# EAGLE design WS2812-Breakout-v1 (EAGLE 5.12)
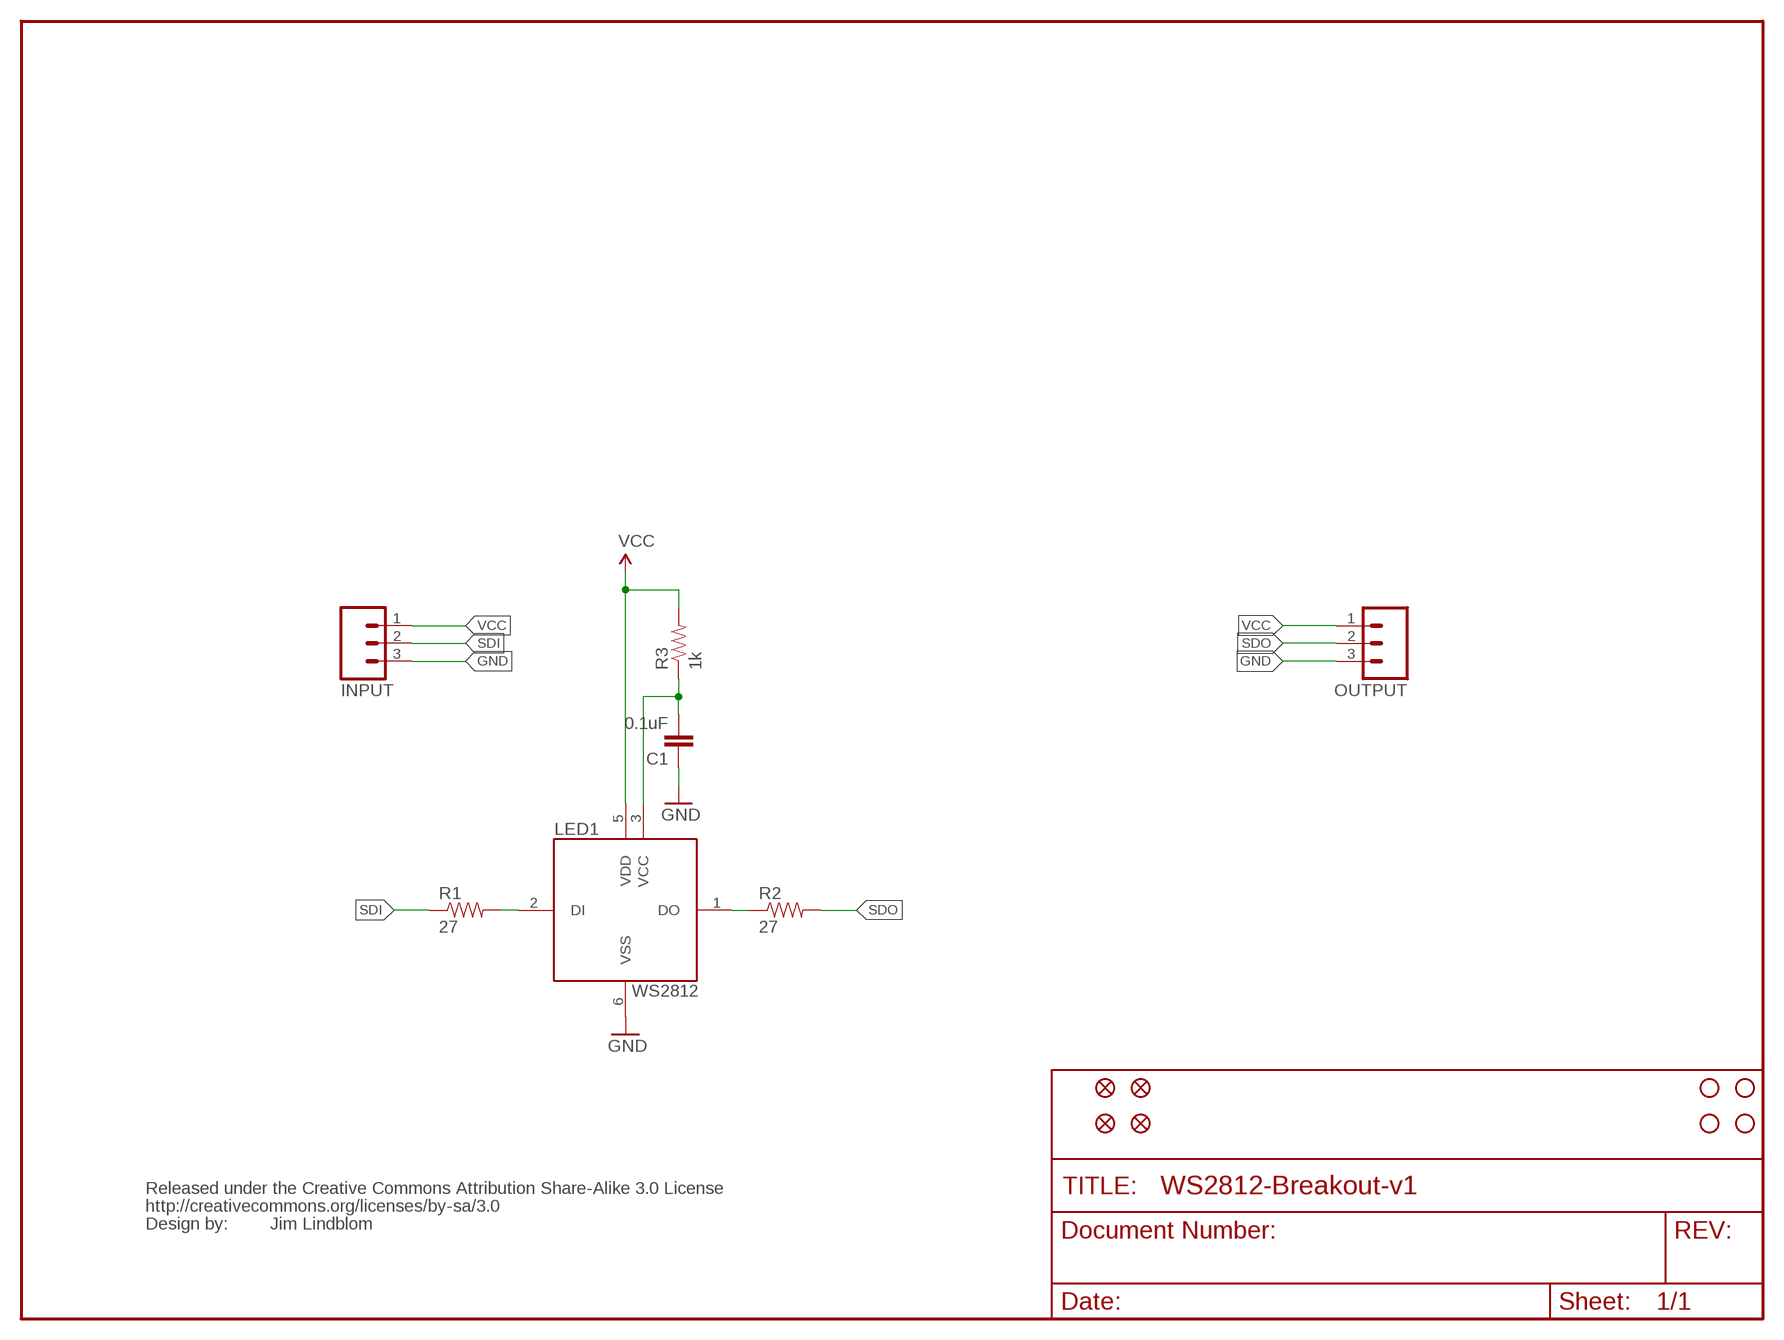
[diagram p0: schematic, sheet 1]

## Parts
C1  0.1uF  CAP0402-CAP  [0402-CAP]
INPUT  M03PTH  [1X03]
JP1  STAND-OFF  [STAND-OFF]
JP2  STAND-OFF  [STAND-OFF]
JP4  STAND-OFF  [STAND-OFF]
JP5  STAND-OFF  [STAND-OFF]
JP6  FIDUCIAL1X2  [FIDUCIAL-1X2]
JP7  FIDUCIAL1X2  [FIDUCIAL-1X2]
JP8  FIDUCIAL1X2  [FIDUCIAL-1X2]
JP9  FIDUCIAL1X2  [FIDUCIAL-1X2]
LED1  WS2812  [LED-TRICOLOR-5050]
OUTPUT  M03PTH  [1X03]
R1  27  RESISTOR0402-RES  [0402-RES]
R2  27  RESISTOR0402-RES  [0402-RES]
R3  1k  RESISTOR0402-RES  [0402-RES]
U$1  CREATIVE_COMMONS  [CREATIVE_COMMONS]

## Nets
GND: C1.1 INPUT.3 LED1.6(VSS) OUTPUT.3
N$1: LED1.2(DI) R1.2
N$2: LED1.1(DO) R2.1
N$3: C1.2 LED1.3(VCC) R3.1
SDI: INPUT.2 R1.1
SDO: OUTPUT.2 R2.2
VCC: INPUT.1 LED1.5(VDD) OUTPUT.1 R3.2

## Notes on the sheet
- Jim Lindblom

## Library data of the parts
C1 = SparkFun:CAP: Capacitor Standard 0603 ceramic capacitor, and 0.1" leaded capacitor.
INPUT OUTPUT = SparkFun:M03: Header 3 Standard 3-pin 0.1" header. Use with straight break away headers (SKU : PRT-00116), right angle break away headers (PRT-00553), swiss pins (PRT-00743), machine pins (PRT-00117), and female headers (PRT-00115). Molex polarized connector foot print use with SKU : PRT-08232 with associated crimp pins and housings.
JP1 JP2 JP4 JP5 = SparkFun:STAND-OFF: Stand Off This is the mechanical footprint for a #4 phillips button head screw. Use the keepout ring to avoid running the screw head into surrounding components. SKU : PRT-00447
JP6-JP9 = SparkFun:FIDUCIAL: Fiducial Alignment Points Various fiducial points for machine vision alignment.
LED1 = rbg-worldsemi-led:WS2812
R1-R3 = SparkFun:RESISTOR: Resistor Basic schematic elements and footprints for 0603, 1206, and PTH resistors.
U$1 = SparkFun:CREATIVE_COMMONS

## Board
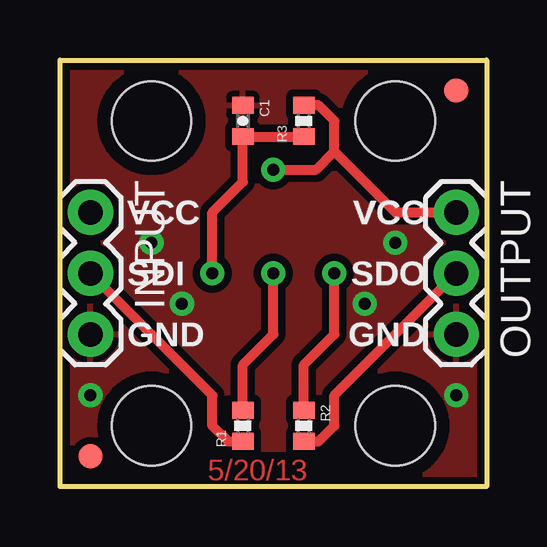
[diagram p1: board, top side]
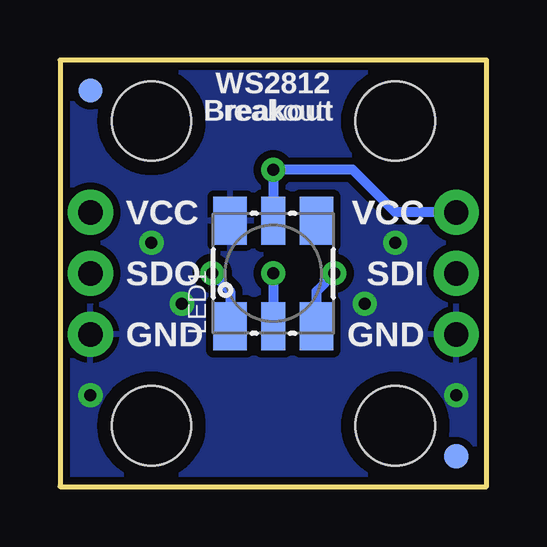
[diagram p2: board, bottom side, seen from below]

Size 17.78 x 17.78 mm. Coordinates in mm from the lower left corner, seen from the top.
Outline: 0,0 0,17.78 17.78,17.78 17.78,0 0,0
Copper layers (1*16): Top 0.035mm / dielectric 1.5mm / Bottom 0.035mm
Design rules "SparkFun *": minimum track width 8mil, minimum drill 20mil, track to track 8mil, track to pad 8mil, pad to pad 8mil, via to via 8mil, smd to smd 8mil, copper to edge 8mil, drill to drill 8mil, minimum pad ring 12mil, minimum via ring 10mil, stop-mask expansion 4mil, vias tented up to drill 20mil, thermal gap 10mil

### Footprints (pad centres in the part's own frame; a part is rotated, then mirrored left to right if it is on the bottom)
0402-CAP = smd 0.7 x 0.9: 1 -0.65,0; 2 0.65,0
1X03 = drill 1.016 pad 1.88 round: 1 0,0; 2 2.54,0; 3 5.08,0
STAND-OFF = hole 3.302: 0,0
FIDUCIAL-1X2 = smd 1 x 1: 1 0,0
LED-TRICOLOR-5050 = smd 2 x 1.4: 1 -2.2,1.8; 3 -2.2,-1.8; 4 2.2,-1.8; 6 2.2,1.8 | smd 2 x 1: 2 -2.2,0; 5 2.2,0
0402-RES = smd 0.7 x 0.9: 1 -0.65,0; 2 0.65,0

### Placement (x,y rotation side)
C1  7.62,15.24 270 top
INPUT  1.27,11.43 270 top
JP1  13.97,15.24 0 top
JP2  3.81,2.54 0 top
JP4  3.81,15.24 0 top
JP5  13.97,2.54 0 top
JP6  16.51,16.51 0 top
JP7  1.27,1.27 0 top
JP8  1.27,1.27 0 bottom
JP9  16.51,16.51 0 bottom
LED1  8.89,8.89 90 bottom
OUTPUT  16.51,11.43 270 top
R1  7.62,2.54 90 top
R2  10.16,2.54 270 top
R3  10.16,15.24 90 top
U$1  -13.97,-8.89 0 top  (outside the outline)

### Tracks (layer width: path | path; a pad name or v marks a point on that pad's centre or on a via)
GND  (via drill 0.5)
  other vias: 3.81,10.16 13.97,10.16 1.27,3.81 16.51,3.81 5.08,7.62 12.7,7.62
  pour Top (isolate 0.305): 0,17.78 0,0 17.78,0 17.78,17.78
  pour Bottom (isolate 0.305): 0,17.78 0,0 17.78,0 17.78,17.78
N$1  (via drill 0.5)
  Top 0.406: v8.89,8.89 8.89,6.35 7.62,5.08 R1.2
  Bottom 0.406: v8.89,8.89 LED1.2
N$2  (via drill 0.5)
  Top 0.406: v11.43,8.89 11.43,6.35 10.16,5.08 R2.1
  Bottom 0.406: LED1.1 10.69,8.15 v11.43,8.89
N$3  (via drill 0.5)
  Top 0.406: R3.1 C1.2 7.62,12.7 6.35,11.43 v6.35,8.89
  Bottom 0.406: LED1.3 7.09,8.15 v6.35,8.89
SDI
  Top 0.406: R1.1 7,1.89 6.35,2.54 6.35,3.81 INPUT.2
SDO
  Top 0.406: R2.2 10.78,1.89 11.43,2.54 11.43,3.81 OUTPUT.2
VCC  (via drill 0.5)
  Top 0.406: R3.2 10.78,15.89 11.43,15.24 11.43,13.97 | 11.43,13.97 13.97,11.43 OUTPUT.1 | v8.89,13.21 10.67,13.21 11.43,13.97
  Bottom 0.406: LED1.5 v8.89,13.21 5.59,13.21 3.81,11.43 INPUT.1

### Text on the board
Top: 5/20/13
tPlace: VCC | VCC | SDO | SDI | GND | GND
bPlace: WS2812 | Breakout | VCC | VCC | SDI | SDO | GND | GND
_tsilk: VCC | VCC | SDO | SDI | GND | GND
_bsilk: WS2812 | Breakout | VCC | VCC | SDI | SDO | GND | GND